# Altium schematic sheet CONTROL_PCB_MAIN.SchDoc
size 350 x 250 mm; SheetNumber: 1; SheetTotal: 13
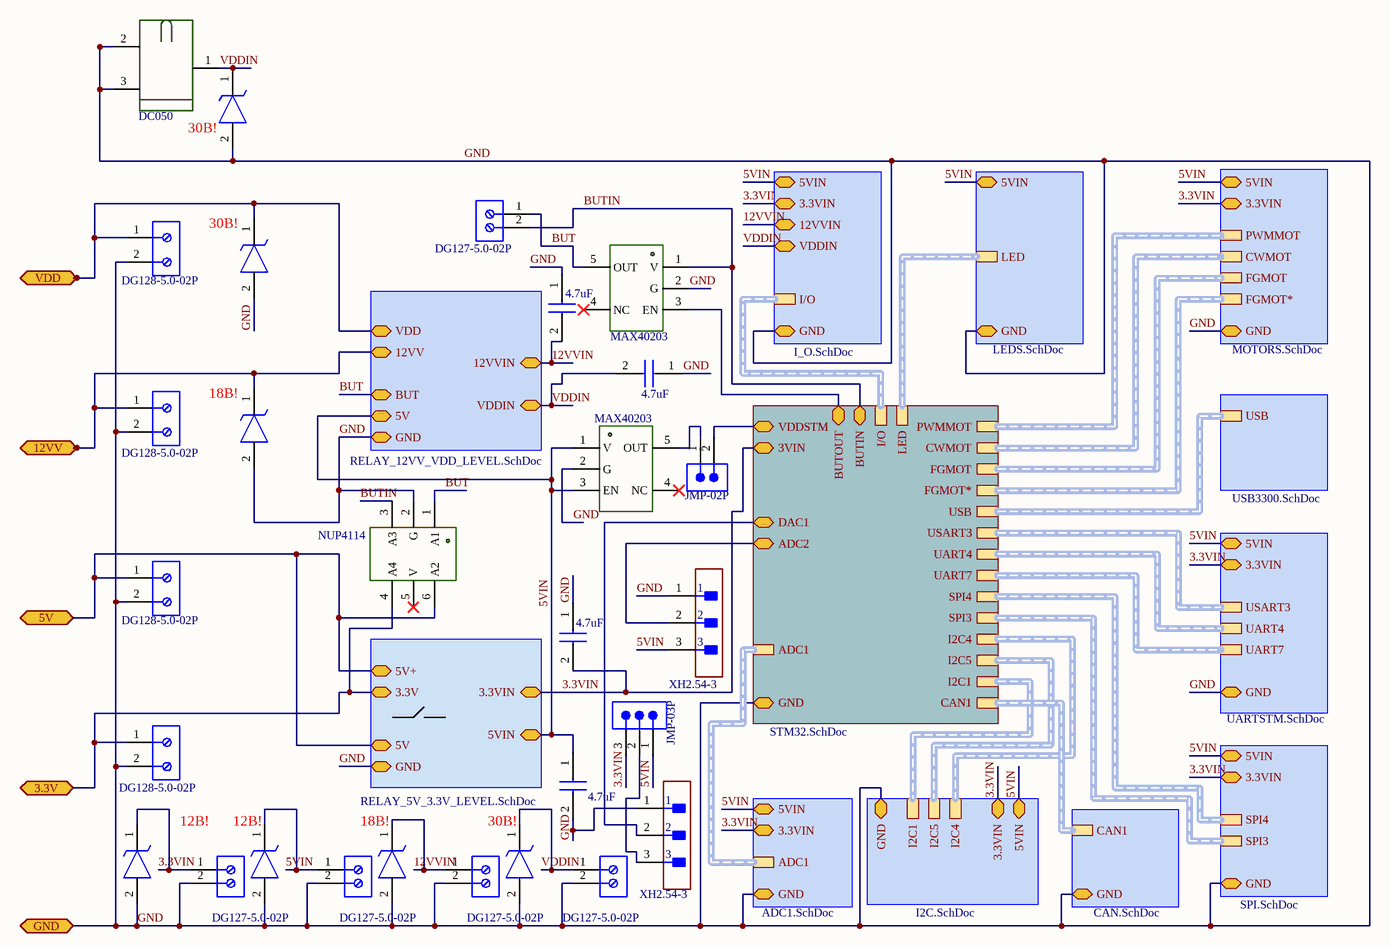
[diagram p0: CONTROL_PCB_MAIN.SchDoc]

## Parts
CAP3.3VIN  4.7uF  [CAP0805]
CAP5VIN  4.7uF  [CAP0805]
CAP12VVIN  4.7uF  [CAP0805]
CAPVDDIN  4.7uF  [CAP0805]
DC050_VDD  DC050  [DC050]
DGBUT  DG127-5.0-02P  [DG127-5.0-02P]
DGIN3.3V2  DG128-5.0-02P  [DG128-5.0-02P]
DGIN5V2  DG128-5.0-02P  [DG128-5.0-02P]
DGIN12VV2  DG128-5.0-02P  [DG128-5.0-02P]
DGOUT3.3V  DG127-5.0-02P  [DG127-5.0-02P]
DGOUT5V  DG127-5.0-02P  [DG127-5.0-02P]
DGOUT12VV  DG127-5.0-02P  [DG127-5.0-02P]
DGOUTVDD  DG127-5.0-02P  [DG127-5.0-02P]
DGVDD2  DG128-5.0-02P  [DG128-5.0-02P]
ESD12VV  SM6T30A  [SM6T-A]  (value not drawn)
ESDOUT3V  SM6T30A  [SM6T-A]  (value not drawn)
ESDOUT5V  SM6T30A  [SM6T-A]  (value not drawn)
ESDOUT12V  SM6T30A  [SM6T-A]  (value not drawn)
ESDOUTVDD  SM6T30A  [SM6T-A]  (value not drawn)
ESDPLUG_VDD  SM6T30A  [SM6T-A]  (value not drawn)
ESDVDD  SM6T30A  [SM6T-A]  (value not drawn)
JMPDC1  JMP-03P  [JMP-03P]
JMPSTM5V  JMP-02P  [JMP-02P]
MAX5VSTM  MAX40203  [MAX40203]
MAXBUT  MAX40203  [MAX40203]
NUPIN  NUP4114  [NUP4114]
XHADC2  XH2.54-3  [XH2.54-3]
XHDAC1  XH2.54-3  [XH2.54-3]

## Sub-sheets
U_ADC1 = ADC1.SchDoc: ADC1 (harness ADC1), 5VIN (bidir), 3.3VIN (bidir), GND (bidir)
U_CAN = CAN.SchDoc: CAN1 (harness CAN1), GND (bidir)
U_I2C = I2C.SchDoc: I2C4 (harness I2C4), 5VIN (bidir), 3.3VIN (bidir), GND (bidir), I2C5 (harness I2C5), I2C1 (harness I2C1)
U_I_O = I_O.SchDoc: I/O (harness I/O), 5VIN (bidir), 3.3VIN (bidir), GND (bidir), 12VVIN (bidir), VDDIN (bidir)
U_LEDS = LEDS.SchDoc: LED (harness LEDs), 5VIN (bidir), GND (bidir)
U_MOTORS = MOTORS.SchDoc: FGMOT (harness FGMOT), CWMOT (harness CWMOT), PWMMOT (harness PWMMOT), FGMOT* (harness FGMOT*), 5VIN (bidir), GND (bidir), 3.3VIN (bidir)
U_RELAY_5V_3.3V_LEVEL = RELAY_5V_3.3V_LEVEL.SchDoc: 3.3V (bidir), 5V (bidir), GND (bidir), 5V+ (bidir), 3.3VIN (bidir), 5VIN (bidir)
U_RELAY_12VV_VDD_LEVEL = RELAY_12VV_VDD_LEVEL.SchDoc: 12VV (bidir), 5V (bidir), GND (bidir), VDD (bidir), 12VVIN (bidir), VDDIN (bidir), BUT (bidir)
U_SPI = SPI.SchDoc: SPI3 (harness SPI3), 5VIN (bidir), 3.3VIN (bidir), GND (bidir), SPI4 (harness SPI4)
U_STM32 = STM32.SchDoc: VDDSTM (bidir), GND (bidir), PWMMOT (harness PWMOT), CWMOT (harness CWMOT), FGMOT (harness FGMOT), FGMOT* (harness FGMOT*), BUTIN (bidir), USB (harness USB3300), USART3 (harness USART3), UART4 (harness USART4), UART7 (harness USART7), SPI4 (harness SPI4), SPI3 (harness SPI3), I2C4 (harness I2C4), I2C5 (harness I2C5), I2C1 (harness I2C1), CAN1 (harness CAN1), DAC1 (bidir), ADC1 (harness ADC1), ADC2 (bidir), LED (harness LEDs), I/O (harness I/O), 3VIN (bidir), BUTOUT (bidir)
U_UARTSTM = UARTSTM.SchDoc: USART3 (harness USART3), UART4 (harness UART4), UART7 (harness UART7), 5VIN (bidir), 3.3VIN (bidir), GND (bidir)
U_USB3300 = USB3300.SchDoc: USB (harness USB3300)

## Ports
3.3V (bidir), 5V (bidir), 12VV (bidir), GND (bidir), VDD (bidir)

## Nets
3.3V: DGIN3.3V2.1 NUPIN.4(A4) ; port 3.3V, sheet U_RELAY_5V_3.3V_LEVEL/3.3V
3.3VIN: CAP3.3VIN.2 DGOUT3.3V.1 ESDOUT3V.1 JMPDC1.3 ; sheet U_RELAY_5V_3.3V_LEVEL/3.3VIN, sheet U_STM32/3VIN, sheet U_MOTORS/3.3VIN, sheet U_UARTSTM/3.3VIN, sheet U_SPI/3.3VIN, sheet U_I2C/3.3VIN, sheet U_ADC1/3.3VIN, sheet U_I_O/3.3VIN
5V: DGIN5V2.1 NUPIN.6(A2) ; port 5V, sheet U_RELAY_5V_3.3V_LEVEL/5V, sheet U_RELAY_5V_3.3V_LEVEL/5V+
5VIN: CAP5VIN.1 DGOUT5V.1 ESDOUT5V.1 JMPDC1.1 MAX5VSTM.1(V) MAX5VSTM.3(EN) XHADC2.3 ; sheet U_RELAY_5V_3.3V_LEVEL/5VIN, sheet U_MOTORS/5VIN, sheet U_UARTSTM/5VIN, sheet U_SPI/5VIN, sheet U_I2C/5VIN, sheet U_ADC1/5VIN, sheet U_LEDS/5VIN, sheet U_I_O/5VIN, sheet U_RELAY_12VV_VDD_LEVEL/5V
12VV: DGIN12VV2.1 ESD12VV.1 ; port 12VV, sheet U_RELAY_12VV_VDD_LEVEL/12VV
12VVIN: CAP12VVIN.2 DGOUT12VV.1 ESDOUT12V.1 ; sheet U_I_O/12VVIN, sheet U_RELAY_12VV_VDD_LEVEL/12VVIN
BUT: DGBUT.1 MAXBUT.5(OUT) NUPIN.1(A1) ; sheet U_RELAY_12VV_VDD_LEVEL/BUT
BUTIN: DGBUT.2 MAXBUT.1(V) NUPIN.3(A3) ; sheet U_STM32/BUTIN
GND: CAP3.3VIN.1 CAP5VIN.2 CAP12VVIN.1 CAPVDDIN.1 DC050_VDD.2 DC050_VDD.3 DGIN3.3V2.2 DGIN5V2.2 DGIN12VV2.2 DGOUT3.3V.2 DGOUT5V.2 DGOUT12VV.2 DGOUTVDD.2 DGVDD2.2 ESD12VV.2 ESDOUT3V.2 ESDOUT5V.2 ESDOUT12V.2 ESDOUTVDD.2 ESDPLUG_VDD.2 ESDVDD.2 MAX5VSTM.2(G) MAXBUT.2(G) NUPIN.2(G) XHADC2.1 XHDAC1.1 ; port GND, sheet U_RELAY_5V_3.3V_LEVEL/GND, sheet U_STM32/GND, sheet U_MOTORS/GND, sheet U_UARTSTM/GND, sheet U_SPI/GND, sheet U_I2C/GND, sheet U_CAN/GND, sheet U_ADC1/GND, sheet U_LEDS/GND, sheet U_I_O/GND, sheet U_RELAY_12VV_VDD_LEVEL/GND
VDD: DGVDD2.1 ESDVDD.1 ; port VDD, sheet U_RELAY_12VV_VDD_LEVEL/VDD
VDDIN: CAPVDDIN.2 DC050_VDD.1 DGOUTVDD.1 ESDOUTVDD.1 ESDPLUG_VDD.1 ; sheet U_I_O/VDDIN, sheet U_RELAY_12VV_VDD_LEVEL/VDDIN
NetJMPDC1_2: JMPDC1.2 XHDAC1.3
NetJMPSTM5V_1: JMPSTM5V.1 MAX5VSTM.5(OUT)
NetJMPSTM5V_2: JMPSTM5V.2 ; sheet U_STM32/VDDSTM
NetMAXBUT_3: MAXBUT.3(EN) ; sheet U_STM32/BUTOUT
NetXHADC2_2: XHADC2.2 ; sheet U_STM32/ADC2
NetXHDAC1_2: XHDAC1.2 ; sheet U_STM32/DAC1

Not connected (* = marked no-connect by the designer): MAX5VSTM 4(NC)*; MAXBUT 4(NC)*; NUPIN 5(V)*

## Buses and harness runs
harness sheet U_ADC1/ADC1 = sheet U_STM32/ADC1
harness sheet U_CAN/CAN1 = sheet U_STM32/CAN1
harness sheet U_I2C/I2C1 = sheet U_STM32/I2C1
harness sheet U_I2C/I2C4 = sheet U_STM32/I2C4
harness sheet U_I2C/I2C5 = sheet U_STM32/I2C5
harness sheet U_I_O/I/O = sheet U_STM32/I/O
harness sheet U_LEDS/LED = sheet U_STM32/LED
harness sheet U_MOTORS/CWMOT = sheet U_STM32/CWMOT
harness sheet U_MOTORS/FGMOT = sheet U_STM32/FGMOT
harness sheet U_MOTORS/FGMOT* = sheet U_STM32/FGMOT*
harness sheet U_MOTORS/PWMMOT = sheet U_STM32/PWMMOT
harness sheet U_SPI/SPI3 = sheet U_STM32/SPI3
harness sheet U_SPI/SPI4 = sheet U_STM32/SPI4
harness sheet U_STM32/UART4 = sheet U_UARTSTM/UART4
harness sheet U_STM32/UART7 = sheet U_UARTSTM/UART7
harness sheet U_STM32/USART3 = sheet U_UARTSTM/USART3
harness sheet U_STM32/USB = sheet U_USB3300/USB

## Notes on the sheet
- (near ESDPLUG_VDD) 30В!
- (near ESDVDD) 30В!
- (near ESD12VV) 18В!
- 12В!
- (near ESDOUT5V) 12В!
- (near ESDOUT12V) 18В!
- (near ESDOUTVDD) 30В!

## Library data of the parts
CAP3.3VIN CAP5VIN CAP12VVIN CAPVDDIN = CAP0805: CAP-SMD0805
DC050_VDD = DC050: DC050-T
DGBUT DGOUT3.3V DGOUT5V DGOUT12VV DGOUTVDD = DG127-5.0-02P: DG127-5.0-02P-14-00Z
DGIN3.3V2 DGIN5V2 DGIN12VV2 DGVDD2 = DG128-5.0-02P: DG128-5.0-02P-14
ESD12VV ESDOUT3V ESDOUT5V ESDOUT12V ESDOUTVDD ESDPLUG_VDD ESDVDD = SM6T-A: SM6T12A-SMD
JMPDC1 = JMP-03P: PLS-1x3
JMPSTM5V = JMP-02P: PLS-1x2
MAX5VSTM MAXBUT = MAX40203: MAX40203AUK+T
NUPIN = NUP4114: NUP4114HMR6T1G
XHADC2 XHDAC1 = XH2.54-3: JST XH2.54-3pin